# Altium project Walter_MotherBoard.PrjPcb
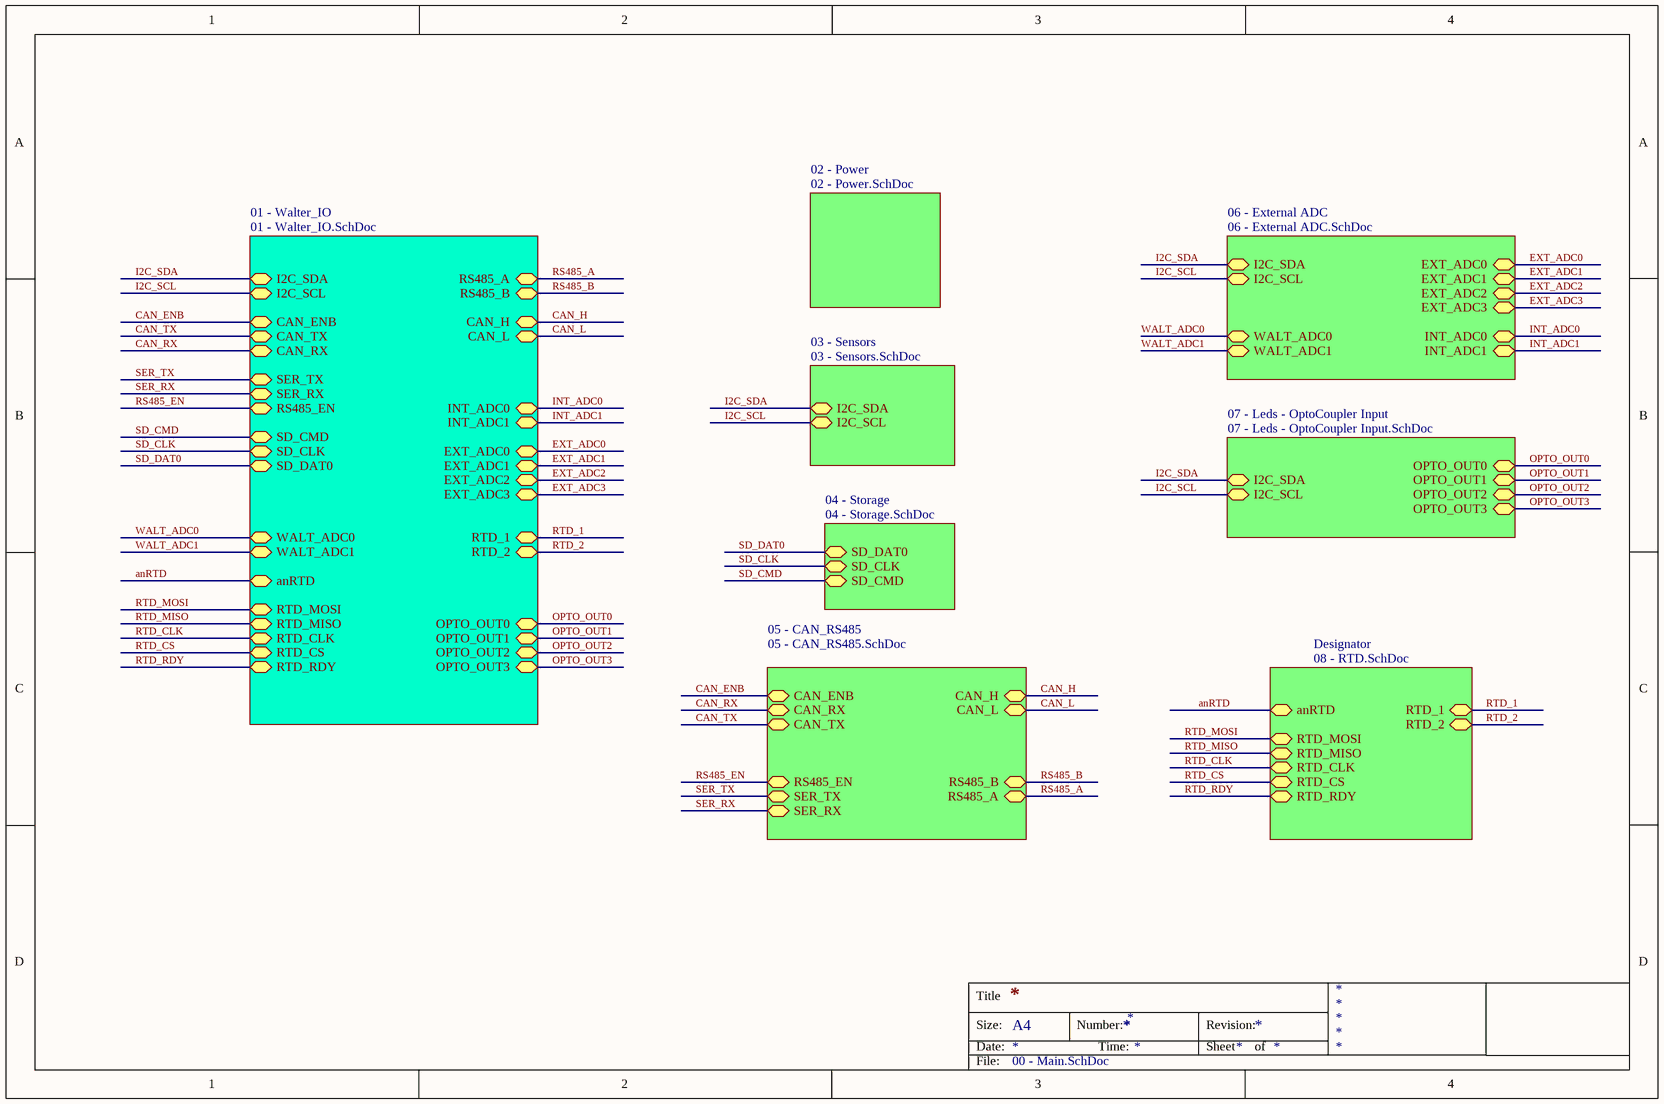
[diagram p0: 00 - Main.SchDoc]
9 sheets, 134 parts. Net scope: global (net labels, ports and power ports of the same name join across sheets).
Board file: SBTech_IcarusBoard_1V0.PcbDoc
Sheets:
  00 - Main.SchDoc
    02 - Power = 02 - Power.SchDoc
    03 - Sensors = 03 - Sensors.SchDoc
    04 - Storage = 04 - Storage.SchDoc
    05 - CAN_RS485 = 05 - CAN_RS485.SchDoc
    06 - External ADC = 06 - External ADC.SchDoc
    07 - Leds - OptoCoupler Input = 07 - Leds - OptoCoupler Input.SchDoc
    Designator = 08 - RTD.SchDoc
    01 - Walter_IO = 01 - Walter_IO.SchDoc

## Sheet 00 - Main.SchDoc
size A4

### Sub-sheets
01 - Walter_IO = 01 - Walter_IO.SchDoc: CAN_L (bidir), CAN_H (bidir), INT_ADC1 (bidir), WALT_ADC0 (bidir), EXT_ADC3 (bidir), INT_ADC0 (bidir), I2C_SDA (bidir), RS485_B (bidir), SD_DAT0 (bidir), RS485_A (bidir), I2C_SCL (bidir), SER_TX (bidir), SD_CMD (bidir), SD_CLK (bidir), SER_RX (bidir), EXT_ADC2 (bidir), EXT_ADC1 (bidir), CAN_RX (bidir), CAN_TX (bidir), RS485_EN (bidir), EXT_ADC0 (bidir), OPTO_OUT3 (bidir), RTD_MISO (bidir), RTD_2 (bidir), OPTO_OUT1 (bidir), RTD_RDY (bidir), OPTO_OUT0 (bidir), RTD_MOSI (bidir), RTD_CLK (bidir), WALT_ADC1 (bidir), OPTO_OUT2 (bidir), RTD_1 (bidir), RTD_CS (bidir), anRTD (bidir), CAN_ENB (bidir)
02 - Power = 02 - Power.SchDoc: no entries
03 - Sensors = 03 - Sensors.SchDoc: I2C_SCL (bidir), I2C_SDA (bidir)
04 - Storage = 04 - Storage.SchDoc: SD_DAT0 (bidir), SD_CLK (bidir), SD_CMD (bidir)
05 - CAN_RS485 = 05 - CAN_RS485.SchDoc: CAN_H (bidir), CAN_L (bidir), SER_TX (bidir), SER_RX (bidir), RS485_A (bidir), CAN_TX (bidir), CAN_RX (bidir), RS485_B (bidir), RS485_EN (bidir), CAN_ENB (bidir)
06 - External ADC = 06 - External ADC.SchDoc: I2C_SDA (bidir), I2C_SCL (bidir), WALT_ADC0 (bidir), EXT_ADC0 (bidir), EXT_ADC1 (bidir), INT_ADC0 (bidir), EXT_ADC2 (bidir), EXT_ADC3 (bidir), INT_ADC1 (bidir), WALT_ADC1 (bidir)
07 - Leds - OptoCoupler Input = 07 - Leds - OptoCoupler Input.SchDoc: OPTO_OUT1 (bidir), OPTO_OUT3 (bidir), OPTO_OUT2 (bidir), OPTO_OUT0 (bidir), I2C_SDA (bidir), I2C_SCL (bidir)
Designator = 08 - RTD.SchDoc: anRTD (bidir), RTD_1 (bidir), RTD_MISO (bidir), RTD_CLK (bidir), RTD_CS (bidir), RTD_RDY (bidir), RTD_2 (bidir), RTD_MOSI (bidir)

### Nets
anRTD: sheet Designator/anRTD, sheet 01 - Walter_IO/anRTD
CAN_ENB: sheet 05 - CAN_RS485/CAN_ENB, sheet 01 - Walter_IO/CAN_ENB
CAN_H: sheet 05 - CAN_RS485/CAN_H, sheet 01 - Walter_IO/CAN_H
CAN_L: sheet 05 - CAN_RS485/CAN_L, sheet 01 - Walter_IO/CAN_L
CAN_RX: sheet 05 - CAN_RS485/CAN_RX, sheet 01 - Walter_IO/CAN_RX
CAN_TX: sheet 05 - CAN_RS485/CAN_TX, sheet 01 - Walter_IO/CAN_TX
EXT_ADC0: sheet 06 - External ADC/EXT_ADC0, sheet 01 - Walter_IO/EXT_ADC0
EXT_ADC1: sheet 06 - External ADC/EXT_ADC1, sheet 01 - Walter_IO/EXT_ADC1
EXT_ADC2: sheet 06 - External ADC/EXT_ADC2, sheet 01 - Walter_IO/EXT_ADC2
EXT_ADC3: sheet 06 - External ADC/EXT_ADC3, sheet 01 - Walter_IO/EXT_ADC3
I2C_SCL: sheet 03 - Sensors/I2C_SCL, sheet 06 - External ADC/I2C_SCL, sheet 07 - Leds - OptoCoupler Input/I2C_SCL, sheet 01 - Walter_IO/I2C_SCL
I2C_SDA: sheet 03 - Sensors/I2C_SDA, sheet 06 - External ADC/I2C_SDA, sheet 07 - Leds - OptoCoupler Input/I2C_SDA, sheet 01 - Walter_IO/I2C_SDA
INT_ADC0: sheet 06 - External ADC/INT_ADC0, sheet 01 - Walter_IO/INT_ADC0
INT_ADC1: sheet 06 - External ADC/INT_ADC1, sheet 01 - Walter_IO/INT_ADC1
OPTO_OUT0: sheet 07 - Leds - OptoCoupler Input/OPTO_OUT0, sheet 01 - Walter_IO/OPTO_OUT0
OPTO_OUT1: sheet 07 - Leds - OptoCoupler Input/OPTO_OUT1, sheet 01 - Walter_IO/OPTO_OUT1
OPTO_OUT2: sheet 07 - Leds - OptoCoupler Input/OPTO_OUT2, sheet 01 - Walter_IO/OPTO_OUT2
OPTO_OUT3: sheet 07 - Leds - OptoCoupler Input/OPTO_OUT3, sheet 01 - Walter_IO/OPTO_OUT3
RS485_A: sheet 05 - CAN_RS485/RS485_A, sheet 01 - Walter_IO/RS485_A
RS485_B: sheet 05 - CAN_RS485/RS485_B, sheet 01 - Walter_IO/RS485_B
RS485_EN: sheet 05 - CAN_RS485/RS485_EN, sheet 01 - Walter_IO/RS485_EN
RTD_1: sheet Designator/RTD_1, sheet 01 - Walter_IO/RTD_1
RTD_2: sheet Designator/RTD_2, sheet 01 - Walter_IO/RTD_2
RTD_CLK: sheet Designator/RTD_CLK, sheet 01 - Walter_IO/RTD_CLK
RTD_CS: sheet Designator/RTD_CS, sheet 01 - Walter_IO/RTD_CS
RTD_MISO: sheet Designator/RTD_MISO, sheet 01 - Walter_IO/RTD_MISO
RTD_MOSI: sheet Designator/RTD_MOSI, sheet 01 - Walter_IO/RTD_MOSI
RTD_RDY: sheet Designator/RTD_RDY, sheet 01 - Walter_IO/RTD_RDY
SD_CLK: sheet 04 - Storage/SD_CLK, sheet 01 - Walter_IO/SD_CLK
SD_CMD: sheet 04 - Storage/SD_CMD, sheet 01 - Walter_IO/SD_CMD
SD_DAT0: sheet 04 - Storage/SD_DAT0, sheet 01 - Walter_IO/SD_DAT0
SER_RX: sheet 05 - CAN_RS485/SER_RX, sheet 01 - Walter_IO/SER_RX
SER_TX: sheet 05 - CAN_RS485/SER_TX, sheet 01 - Walter_IO/SER_TX
WALT_ADC0: sheet 06 - External ADC/WALT_ADC0, sheet 01 - Walter_IO/WALT_ADC0
WALT_ADC1: sheet 06 - External ADC/WALT_ADC1, sheet 01 - Walter_IO/WALT_ADC1

### Notes on the sheet
- Title
- Size:
- Date:
- A4
- Number:
- Time:
- Revision:
- Sheet
- of
- File:

## Sheet 02 - Power.SchDoc
size A4
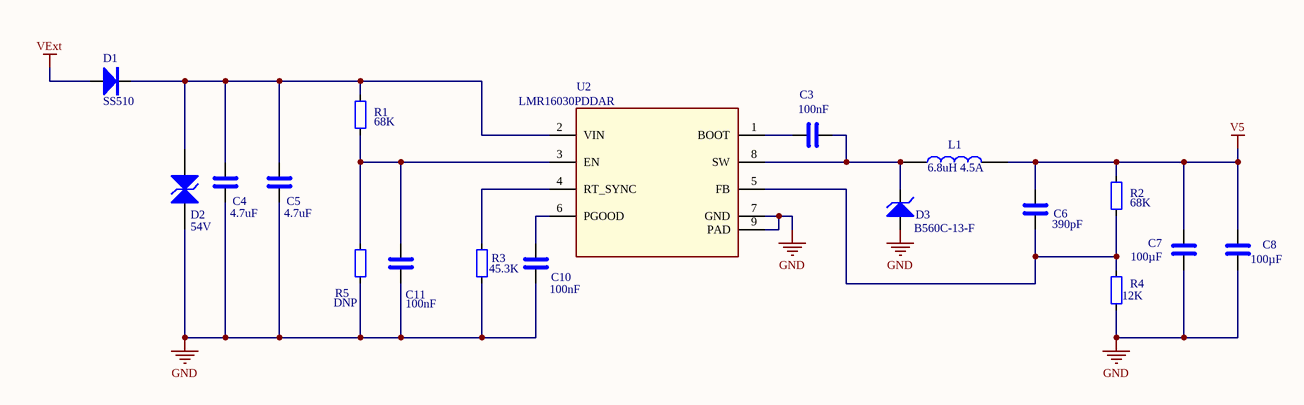
[diagram p1: 02 - Power.SchDoc]

### Parts
C3  100nF  [CAP_0603]
C4  4.7uF  [C_1210_3225Metric]
C5  4.7uF  [C_1210_3225Metric]
C6  390pF  [CAP_0603]
C7  100µF  [C_1210_3225Metric]
C8  100µF  [C_1210_3225Metric]
C10  100nF  [CAP_0603]
C11  100nF  [CAP_0603]
D1  value SS510  [S1M-13-F]  (hidden comment: DIODE SCHOTTKY 100V 5A DO214AC)
D2  value 54V  [SMBJ54CA-HT]  (hidden comment: SMBJ54CA-HT)
D3  B560C-13-F  [SMC_DIO]
L1  6.8uH 4.5A  [IHLP2525CZER6R8M01]
R1  68K  [RES_0603]
R2  68K  [RES_0603]
R3  45.3K  [RES_0603]
R4  12K  [RES_0603]
R5  DNP  [RES_0603]
U2  LMR16030PDDAR  [LMR16030PDDAR]

### Nets
GND: C4.2 C5.2 C7.2 C8.2 C10.2 C11.2 D2.1(A) D3.2(A) R3.1 R4.1 R5.1 U2.7(GND) U2.9(PAD)
V5: C6.1 C7.1 C8.1 L1.2 R2.2
VExt: D1.2(A)
NetC3_1: C3.1 U2.1(BOOT)
NetC3_2: C3.2 D3.1(K) L1.1 U2.8(SW)
NetC4_1: C4.1 C5.1 D1.1(K) D2.2(K) R1.2 U2.2(VIN)
NetC6_2: C6.2 R2.1 R4.2 U2.5(FB)
NetC10_1: C10.1 U2.6(PGOOD)
NetC11_1: C11.1 R1.1 R5.2 U2.3(EN)
NetR3_2: R3.2 U2.4(RT_SYNC)

### Notes on the sheet
- Title
- Size:
- Date:
- A4
- Number:
- Time:
- Revision:
- Sheet
- of
- File:

### Library data of the parts
C3 C10 C11 = C: pdf: https://www.lcsc.com/datasheet/lcsc_datasheet_2501031500_HRE-CGA0603X7R104K500JT_C6119867.pdf; LCSC PART: C6119867; lcsc link: https://www.lcsc.com/product-detail/Multilayer-Ceramic-Capacitors-MLCC-SMD-SMT_HRE-CGA0603X7R104K500JT_C6119867.html?s_z=n_100nF; JLCPCB: C6119867; Value: 100nF
C4 C5 = C: Value: 4.7uF 100V; JLCPCB: C381466; LCSC PART: C381466; lcsc link: https://www.lcsc.com/product-detail/Multilayer-Ceramic-Capacitors-MLCC-SMD-SMT_PSA-Prosperity-Dielectrics-FS32X475K101EGG_C381466.html
C6 = C: 50V 390pF X7R ±10% 0603 Multilayer Ceramic Capacitors MLCC - SMD/SMT ROHS; JLCPCB: C1617; Value: 390pF; LCSC PART: C1617; lcsc link: https://www.lcsc.com/product-detail/Multilayer-Ceramic-Capacitors-MLCC-SMD-SMT_FH-Guangdong-Fenghua-Advanced-Tech-0603B391K500NT_C1617.html?s_z=n_390pF
C7 C8 = C: 6.3V 100uF X5R ±20% 1210 Multilayer Ceramic Capacitors MLCC - SMD/SMT ROHS; JLCPCB: C49066; Value: 100µF; LCSC PART: C49066; lcsc link: https://www.lcsc.com/product-detail/Multilayer-Ceramic-Capacitors-MLCC-SMD-SMT_Samsung-Electro-Mechanics-CL32A107MQVNNNE_C49066.html?s_z=n_C49066
D1 = DIODE SCHOTTKY 100V 5A DO214AC: MFN: SS510-HT; STOK KOD: HM0953; TYPE: SMD; NAME: DIODE SCHOTTKY 100V 5A DO214AC; Datasheet: https://www.smc-diodes.com/propdf/SK510%20N1113%20REV.A.pdf; lcsc link: https://www.lcsc.com/product-detail/Schottky-Diodes_MDD-Microdiode-Semiconductor-SS510_C65010.html; JLCPCB: C65010; LCSC PART: C65010; pdf: https://www.lcsc.com/datasheet/lcsc_datasheet_2411211954_MDD-Microdiode-Semiconductor-SS510_C65010.pdf
D2 = DIODE TVS 600W 54V DO214AA SMB: 600W Bidirectional 54V SMB ESD and Surge Protection (TVS/ESD) ROHS; STOK KOD: HM0531; TYPE: SMD; MFN: SMBJ54CA-HT; NAME: DIODE TVS 600W 54V DO214AA SMB; Datasheet: https://www.littelfuse.com/~/media/electronics/datasheets/tvs_diodes/littelfuse_tvs_diode_smbj_datasheet.pdf.pdf; lcsc link: https://www.lcsc.com/product-detail/ESD-and-Surge-Protection-TVS-ESD_FOSAN-SMBJ54CA_C5353227.html?s_z=n_SMBJ54CA; LCSC PART: C5353227; pdf: https://www.lcsc.com/datasheet/lcsc_datasheet_2301131609_FOSAN-SMBJ54CA_C5353227.pdf; JLCPCB: C5353227
D3 = B560C: 60V 700mV@5A 5A SMC(DO-214AB) Schottky Diodes ROHS; Value: B560C-13-F; LCSC PART: C85100; JLCPCB: C85100; lcsc link: https://www.lcsc.com/product-detail/Schottky-Diodes_Diodes-Incorporated-B560C-13-F_C85100.html?s_z=n_b560c; pdf: https://www.lcsc.com/datasheet/lcsc_datasheet_2412251154_Diodes-Incorporated-B560C-13-F_C85100.pdf
L1 = FIXED IND 6.8UH 4.5A 60 MOHM SMD: 4.5A 6.8uH ±20% 8A SMD,6.5x6.9mm Power Inductors ROHS; MFN: IHLP2525CZER6R8M01; TYPE: SMD; JLCPCB: C506575; LCSC PART: C506575; lcsc link: https://www.lcsc.com/product-detail/Power-Inductors_Vishay-Intertech-IHLP2525CZER6R8M01_C506575.html?s_z=n_IHLP2525CZER6R8M01; pdf: https://www.lcsc.com/datasheet/lcsc_datasheet_2409300703_Vishay-Intertech-IHLP2525CZER6R8M01_C506575.pdf; Value: 6.8uH 4.5A
R1-R5 = R
  R1 R2: Value: 68K; JLCPCB: C114633; LCSC PART: C114633; lcsc link: https://www.lcsc.com/product-detail/Chip-Resistor-Surface-Mount_YAGEO-RC0603FR-0768KL_C114633.html?s_z=n_68K
  R3: Value: 45.3K; LCSC PART: C23058; JLCPCB: C23058; lcsc link: https://www.lcsc.com/product-detail/Chip-Resistor-Surface-Mount_UNI-ROYAL-Uniroyal-Elec-0603WAF4532T5E_C23058.html
  R4: Value: 12K; JLCPCB: C114659; LCSC PART: C114659; lcsc link: https://www.lcsc.com/product-detail/Chip-Resistor-Surface-Mount_YAGEO-RC0603FR-0712KL_C114659.html?s_z=n_12k
  R5: Value: DNP
U2 = IC REG BUCK ADJUSTABLE 3A 8SOPWR: Step-down type Adjustable 800mV~50V 3A 4.3V~60V SOIC-8-EP DC-DC Converters ROHS; STOK KOD: HM0056; MFN: LMR16030PDDAR; TYPE: SMD; NAME: IC REG BUCK ADJUSTABLE 3A 8SOPWR; Datasheet: https://www.ti.com/general/docs/suppproductinfo.tsp?distId=10&gotoUrl=https%3A%2F%2Fwww.ti.com%2Flit%2Fgpn%2Flmr16030; LCSC PART: C90665; JLCPCB: C90665; lcsc link: https://www.lcsc.com/product-detail/DC-DC-Converters_Texas-Instruments-LMR16030PDDAR_C90665.html?s_z=n_LMR16030PDDAR; pdf: https://www.lcsc.com/datasheet/lcsc_datasheet_2410121701_Texas-Instruments-LMR16030PDDAR_C90665.pdf; Value: LMR16030PDDAR

## Sheet 03 - Sensors.SchDoc
size A4
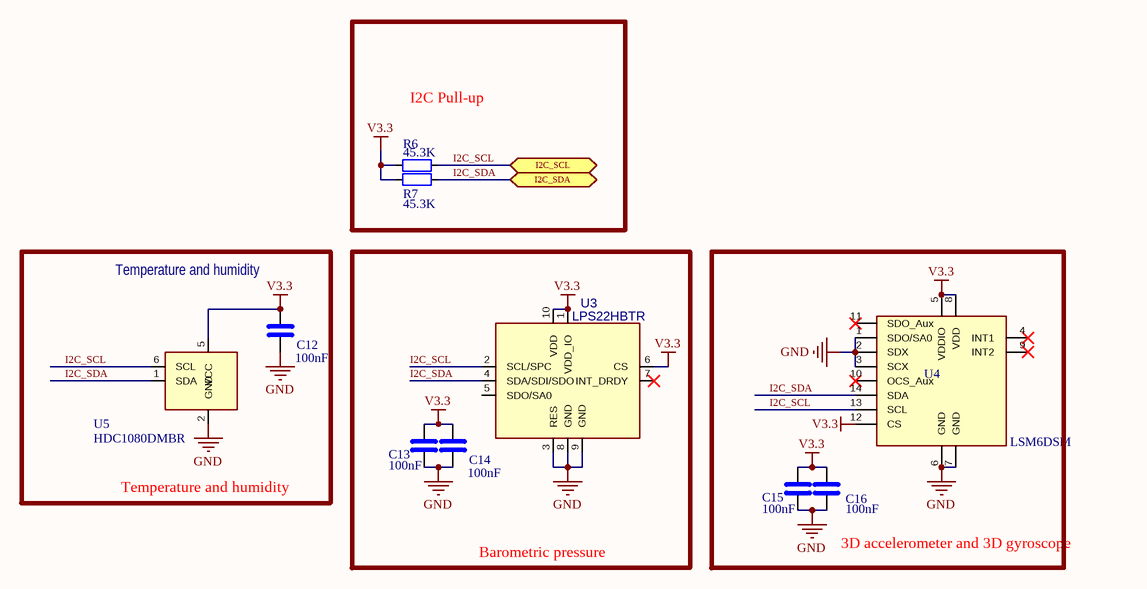
[diagram p2: 03 - Sensors.SchDoc]

### Parts
C12  100nF  [CAP_0603]
C13  100nF  [CAP_0603]
C14  100nF  [CAP_0603]
C15  100nF  [CAP_0603]
C16  100nF  [CAP_0603]
R6  45.3K  [RES_0603]
R7  45.3K  [RES_0603]
U3  value LPS22HBTR  [HLGA10_2X2_STM-L]  (hidden comment: LPS22HH)
U4  LSM6DSM  [LGA-14_3x2.5mm_P0.5mm_LayoutBorder3x4y]
U5  HDC1080DMBR  [Texas_PWSON-N6]

### Blocks framed on the sheet
I2C Pull-up: R6 R7
Barometric pressure: C13 C14 U3
3D accelerometer and 3D gyroscope: C15 C16 U4

### Ports
I2C_SCL (bidir), I2C_SDA (bidir)

### Nets
GND: C12.2 C13.2 C14.2 C15.2 C16.2 U3.3(RES) U3.8(GND) U3.9(GND) U4.1(SDO/SA0) U4.2(SDX) U4.3(SCX) U4.6(GND) U4.7(GND) U5.2(GND)
V3.3: C12.1 C13.1 C14.1 C15.1 C16.1 R6.2 R7.2 U3.1(VDD_IO) U3.6(CS) U3.10(VDD) U4.5(VDDIO) U4.8(VDD) U4.12(CS) U5.5(VCC)
I2C_SCL: R6.1 U3.2(SCL/SPC) U4.13(SCL) U5.6(SCL) ; port I2C_SCL
I2C_SDA: R7.1 U3.4(SDA/SDI/SDO) U4.14(SDA) U5.1(SDA) ; port I2C_SDA

Not connected (* = marked no-connect by the designer): U3 5(SDO/SA0) 7(INT_DRDY)*; U4 4(INT1)* 9(INT2)* 10(OCS_Aux)* 11(SDO_Aux)*; U5 3(NC) 4(NC) 7(DAP)

### Notes on the sheet
- (near C12) Temperature and humidity
- Temperature and humidity
- Title
- Size:
- Date:
- A4
- Number:
- Time:
- Revision:
- Sheet
- of
- File:

### Library data of the parts
C12-C16 = C: pdf: https://www.lcsc.com/datasheet/lcsc_datasheet_2501031500_HRE-CGA0603X7R104K500JT_C6119867.pdf; LCSC PART: C6119867; lcsc link: https://www.lcsc.com/product-detail/Multilayer-Ceramic-Capacitors-MLCC-SMD-SMT_HRE-CGA0603X7R104K500JT_C6119867.html?s_z=n_100nF; JLCPCB: C6119867; Value: 100nF
R6 R7 = R: Value: 45.3K; LCSC PART: C23058; JLCPCB: C23058; lcsc link: https://www.lcsc.com/product-detail/Chip-Resistor-Surface-Mount_UNI-ROYAL-Uniroyal-Elec-0603WAF4532T5E_C23058.html
U3 = LPS22HBTR: 26Kpa~126Kpa HLGA-10(2x2) Pressure Sensors ROHS; LCSC PART: C2827824; Footprint: LPS22HBTR:HLGA10_2X2_STM-L; lcsc link: https://www.lcsc.com/product-detail/Pressure-Sensors_STMicroelectronics-LPS22HHTR_C2827824.html; pdf: https://www.lcsc.com/datasheet/lcsc_datasheet_2209222100_STMicroelectronics-LPS22HHTR_C2827824.pdf; JLCPCB: C2827824
U5 = HDC1080: JLCPCB: C82227; Value: HDC1080DMBR; Footprint: Package_SON:Texas_PWSON-N6; LCSC PART: C82227; lcsc link: https://www.lcsc.com/product-detail/Temperature-and-Humidity-Sensor_Texas-Instruments-HDC1080DMBR_C82227.html?s_z=n_C82227; pdf: https://www.ti.com/lit/ds/symlink/hdc1080.pdf?ts=1737300187160&ref_url=https%253A%252F%252Fwww.google.com%252F
U4 = LSM6DSM: JLCPCB: C94048; Value: LSM6DSM; Footprint: Package_LGA:LGA-14_3x2.5mm_P0.5mm_LayoutBorder3x4y; LCSC PART: C94048; lcsc link: https://www.lcsc.com/product-detail/Accelerometers_STMicroelectronics-LSM6DSMTR_C94048.html?s_z=n_C94048; pdf: https://www.lcsc.com/datasheet/lcsc_datasheet_1811101102_STMicroelectronics-LSM6DSMTR_C94048.pdf

## Sheet 04 - Storage.SchDoc
size A4
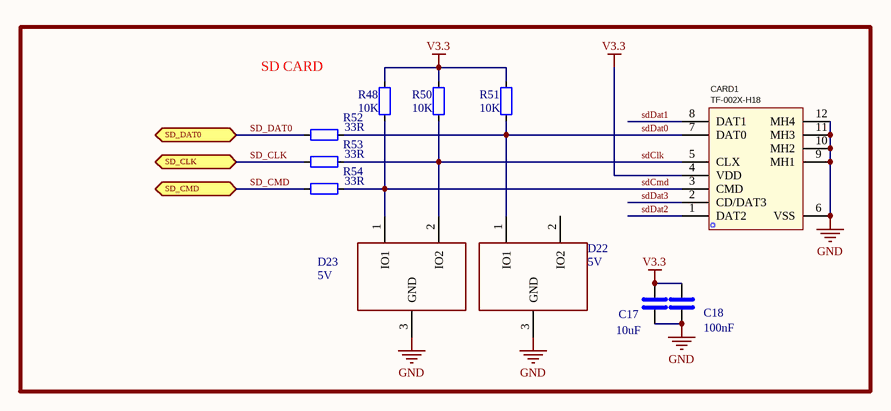
[diagram p3: 04 - Storage.SchDoc]

### Parts
C17  10uF  [CAP_0805]
C18  100nF  [CAP_0603]
CARD1  TF-002X-H18  [SIM-SMD_TF-002-H18]
D22  value 5V  [TPD2E2U06DCKR]  (hidden comment: Q100 TO CATALOG SPIN OF TPD2E2U0)
D23  value 5V  [TPD2E2U06DCKR]  (hidden comment: Q100 TO CATALOG SPIN OF TPD2E2U0)
R48  value 10K  [RES_0603]  (hidden comment: 10K 1%)
R50  value 10K  [RES_0603]  (hidden comment: 10K 1%)
R51  value 10K  [RES_0603]  (hidden comment: 10K 1%)
R52  33R  [RES_0603]
R53  33R  [RES_0603]
R54  33R  [RES_0603]

### Blocks framed on the sheet
SD CARD: C17 C18 CARD1 D22 D23 R48 R50-R54

### Ports
SD_CLK (bidir), SD_CMD (bidir), SD_DAT0 (bidir)

### Nets
GND: C17.2 C18.2 CARD1.6(VSS) CARD1.9(MH1) CARD1.10(MH2) CARD1.11(MH3) CARD1.12(MH4) D22.3(GND) D23.3(GND)
V3.3: C17.1 C18.1 CARD1.4(VDD) R48.1 R50.1 R51.1
SD_CLK: R53.1 ; port SD_CLK
SD_CMD: R54.1 ; port SD_CMD
SD_DAT0: R52.1 ; port SD_DAT0
sdClk: CARD1.5(CLX) D23.2(IO2) R50.2 R53.2
sdCmd: CARD1.3(CMD) D23.1(IO1) R48.2 R54.2
sdDat0: CARD1.7(DAT0) D22.1(IO1) R51.2 R52.2
sdDat1: CARD1.8(DAT1)
sdDat2: CARD1.1(DAT2)
sdDat3: CARD1.2(CD/DAT3)

Not connected (* = marked no-connect by the designer): D22 2(IO2)

### Notes on the sheet
- Title
- Size:
- Date:
- A4
- Number:
- Time:
- Revision:
- Sheet
- of
- File:

### Library data of the parts
C17 C18 = C
  C17: Value: 10uF; lcsc link: https://www.lcsc.com/product-detail/Multilayer-Ceramic-Capacitors-MLCC-SMD-SMT_Samsung-Electro-Mechanics-CL21A106KOQNNNE_C1713.html?s_z=n_C1713; LCSC PART: C1713; JLCPCB: C1713
  C18: pdf: https://www.lcsc.com/datasheet/lcsc_datasheet_2501031500_HRE-CGA0603X7R104K500JT_C6119867.pdf; LCSC PART: C6119867; lcsc link: https://www.lcsc.com/product-detail/Multilayer-Ceramic-Capacitors-MLCC-SMD-SMT_HRE-CGA0603X7R104K500JT_C6119867.html?s_z=n_100nF; JLCPCB: C6119867; Value: 100nF
CARD1 = TF-002X-H18: Card Slot MicroSD card (TF card) Flip type SMD SD Card / Memory Card Connector ROHS; Manufacturer: SOFNG(硕方); Symbol: TF-002-H18; Add into BOM: yes; Device: TF-002X-H18; LCSC Part Name: 翻盖式 MicroSD卡(TF卡) 卡座; Supplier Part: C125814; Manufacturer Part: TF-002X-H18; Supplier Footprint: SMD; JLCPCB Part Class: Extended Part; Datasheet: https://atta.szlcsc.com/upload/public/pdf/source/20200313/C125814_E45762AFA89F96AEF2D8FC2220BDEE92.pdf; Supplier: LCSC; Convert to PCB: yes; Card Connection Mode: Flip type; Card Type: MicroSD card (TF card); Connector Type: Card Slot; Maximum Body Height: -; Operating Temperature Range: -; pdf: https://www.lcsc.com/datasheet/lcsc_datasheet_2410121543_SOFNG-TF-002X-H18_C125814.pdf; lcsc link: https://www.lcsc.com/product-detail/SD-Card-Memory-Card-Connector_SOFNG-TF-002X-H18_C125814.html?s_z=n_microsd; LCSC PART: C125814; Value: TF-002X-H18; JLCPCB: C125814; JLCPCB: C458218
D22 D23 = Q100 TO CATALOG SPIN OF TPD2E2U0: TYPE: SMD; STOK KOD: HM0072; MFN: TPD2E2U06DCKR; NAME: Q100 TO CATALOG SPIN OF TPD2E2U0; JLCPCB: C5310938; LCSC PART: C5310938; lcsc link: https://www.lcsc.com/product-detail/ESD-and-Surge-Protection-TVS-ESD_TECH-PUBLIC-TPD2E2U06QDCKR-TP_C5310938.html?s_z=n_TPD2E2U0; pdf: https://www.lcsc.com/datasheet/lcsc_datasheet_2411121117_TECH-PUBLIC-TPD2E2U06QDCKR-TP_C5310938.pdf
R48 R50 R51 = R: JLCPCB: C25804; LCSC PART: C25804; lcsc link: https://www.lcsc.com/product-detail/Chip-Resistor-Surface-Mount_UNI-ROYAL-Uniroyal-Elec-0603WAF1002T5E_C25804.html
R52-R54 = R: 100mW Thick Film Resistors 75V ±100ppm/℃ ±1% 33Ω 0603 Chip Resistor - Surface Mount ROHS; Value: 33R; LCSC PART: C23140; JLCPCB: C23140; lcsc link: https://www.lcsc.com/product-detail/Chip-Resistor-Surface-Mount_UNI-ROYAL-Uniroyal-Elec-0603WAF330JT5E_C23140.html

## Sheet 05 - CAN_RS485.SchDoc
size A4
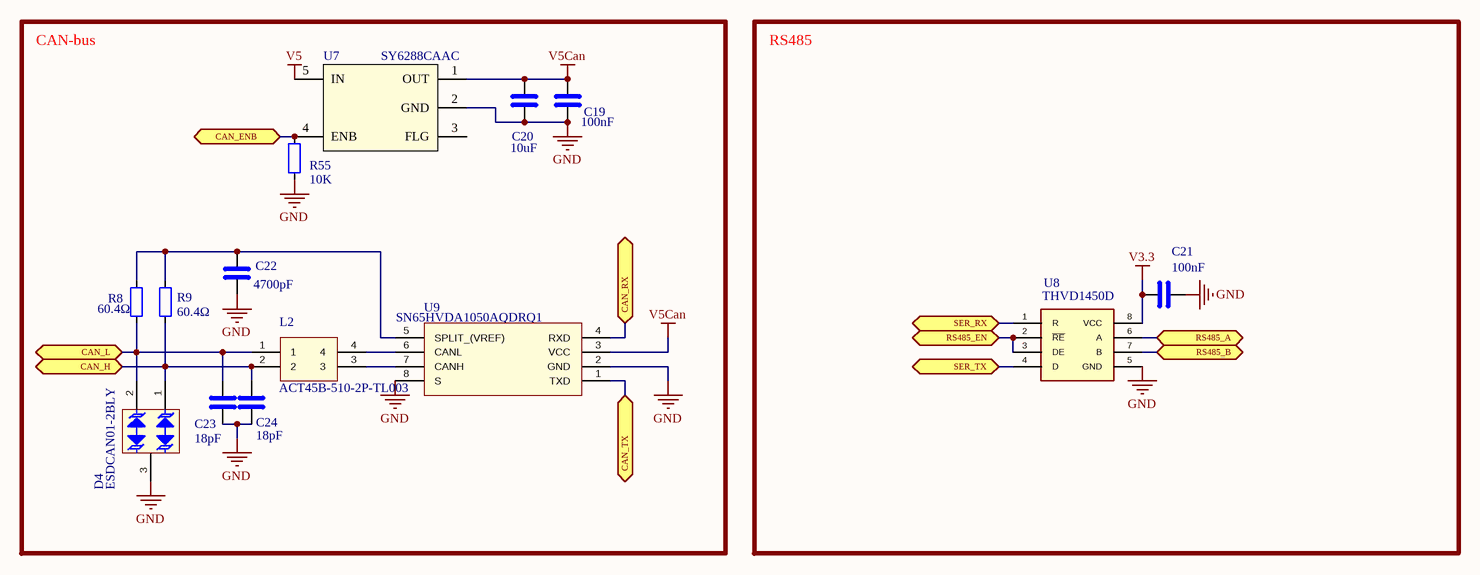
[diagram p4: 05 - CAN_RS485.SchDoc]

### Parts
C19  100nF  [CAP_0603]
C20  10uF  [CAP_0805]
C21  100nF  [CAP_0603]
C22  4700pF  [CAP_0603]
C23  18pF  [CAP_0603]
C24  18pF  [CAP_0603]
D4  ESDCAN01-2BLY  [SOT95P255X150-3N]
L2  ACT45B-510-2P-TL003  [ACT45B1012PTL003]
R8  60.4Ω  [RES_0603]
R9  60.4Ω  [RES_0603]
R55  value 10K  [RES_0603]  (hidden comment: 10K 1%)
U7  SY6288CAAC  [SOT95P285X145-5N]
U8  THVD1450D  [SOIC127P600]
U9  SN65HVDA1050AQDRQ1  [SOIC127P600]

### Blocks framed on the sheet
CAN-bus: C19 C20 C22-C24 D4 L2 R8 R9 R55 U7 U9
RS485: C21 U8

### Ports
CAN_ENB (bidir), CAN_H (bidir), CAN_L (bidir), CAN_RX (bidir), CAN_TX (bidir), RS485_A (bidir), RS485_B (bidir), RS485_EN (bidir), SER_RX (bidir), SER_TX (bidir)

### Nets
GND: C19.2 C20.2 C21.2 C22.2 C23.2 C24.2 D4.3 R55.2 U7.2(GND) U8.5(GND) U9.2(GND) U9.8(S)
V3.3: C21.1 U8.8(VCC)
V5: U7.5(IN)
V5Can: C19.1 C20.1 U7.1(OUT) U9.3(VCC)
CAN_ENB: R55.1 U7.4(ENB) ; port CAN_ENB
CAN_H: C23.1 D4.2 L2.1 R8.1 ; port CAN_L
CAN_L: C24.1 D4.1 L2.2 R9.1 ; port CAN_H
CAN_RX: U9.4(RXD) ; port CAN_RX
CAN_TX: U9.1(TXD) ; port CAN_TX
RS485_A: U8.6(A) ; port RS485_A
RS485_B: U8.7(B) ; port RS485_B
RS485_EN: U8.2(~{RE}) U8.3(DE) ; port RS485_EN
SER_RX: U8.1(R) ; port SER_RX
SER_TX: U8.4(D) ; port SER_TX
NetC22_1: C22.1 R8.2 R9.2 U9.5(SPLIT_(VREF))
NetL2_3: L2.3 U9.7(CANH)
NetL2_4: L2.4 U9.6(CANL)

Not connected (* = marked no-connect by the designer): U7 3(FLG)

### Notes on the sheet
- Title
- Size:
- Date:
- A4
- Number:
- Time:
- Revision:
- Sheet
- of
- File:

### Library data of the parts
C19-C22 = C
  C19 C21: pdf: https://www.lcsc.com/datasheet/lcsc_datasheet_2501031500_HRE-CGA0603X7R104K500JT_C6119867.pdf; LCSC PART: C6119867; lcsc link: https://www.lcsc.com/product-detail/Multilayer-Ceramic-Capacitors-MLCC-SMD-SMT_HRE-CGA0603X7R104K500JT_C6119867.html?s_z=n_100nF; JLCPCB: C6119867; Value: 100nF
  C20: Value: 10uF; lcsc link: https://www.lcsc.com/product-detail/Multilayer-Ceramic-Capacitors-MLCC-SMD-SMT_Samsung-Electro-Mechanics-CL21A106KOQNNNE_C1713.html?s_z=n_C1713; LCSC PART: C1713; JLCPCB: C1713
  C22: JLCPCB: C7503499; Value: 4700pF; lcsc link: https://www.lcsc.com/product-detail/Multilayer-Ceramic-Capacitors-MLCC-SMD-SMT_HRE-CGA0603X7R472K500JT_C7503499.html; LCSC PART: C7503499
C23 C24 = C: 50V 18pF X7R ±10% 0603 Multilayer Ceramic Capacitors MLCC - SMD/SMT ROHS; Value: 18pF; Footprint: Capacitor_SMD:C_0603_1608Metric; LCSC PART: C6119867; lcsc link: https://www.lcsc.com/product-detail/Multilayer-Ceramic-Capacitors-MLCC-SMD-SMT_HRE-CGA0603X7R104K500JT_C6119867.html; JLCPCB: C6119867
D4 = ESDCAN01-2BLY: 5.5A@8/20us 230W 40V 25V 24V SOT-23 ESD and Surge Protection (TVS/ESD) ROHS; PAGE: DPESDCAN01; JLCPCB: C1976606; Value: ESDCAN01-2BLY; LCSC PART: C1976606; lcsc link: https://www.lcsc.com/product-detail/ESD-and-Surge-Protection-TVS-ESD_STMicroelectronics-ESDCAN01-2BLY_C1976606.html?s_z=n_C1976606; pdf: https://www.lcsc.com/datasheet/lcsc_datasheet_2410010332_STMicroelectronics-ESDCAN01-2BLY_C1976606.pdf
L2 = ACT45B-510-2P-TL003: 51uH@100kHz 2.8kΩ@10MHz 1Ω 2 SMD,4.5x3.2mm Common Mode Filters ROHS; PAGE: L51UHACT45B; JLCPCB: C76584; Value: ACT45B-510-2P-TL003; LCSC PART: C76584; lcsc link: https://www.lcsc.com/product-detail/Common-Mode-Filters_TDK-ACT45B-510-2P-TL003_C76584.html?s_z=n_C76584; pdf: https://www.lcsc.com/datasheet/lcsc_datasheet_2412231058_TDK-ACT45B-510-2P-TL003_C76584.pdf
R8 R9 = R: 100mW Thick Film Resistors 75V ±100ppm/℃ ±1% 60.4Ω 0603 Chip Resistor - Surface Mount ROHS; Value: 60.4Ω; JLCPCB: C23090; LCSC PART: C23090; lcsc link: https://www.lcsc.com/product-detail/Chip-Resistor-Surface-Mount_UNI-ROYAL-Uniroyal-Elec-0603WAF604JT5E_C23090.html?s_z=n_60.4R
R55 = R: JLCPCB: C25804; LCSC PART: C25804; lcsc link: https://www.lcsc.com/product-detail/Chip-Resistor-Surface-Mount_UNI-ROYAL-Uniroyal-Elec-0603WAF1002T5E_C25804.html
U7 = AP22802A: 2.5V~5.5V 60mΩ Active High 2A 1 Load Switch SOT-23-5 Power Distribution Switches ROHS; Value: SY6288CAAC; JLCPCB: C111830; LCSC PART: C111830; lcsc link: https://www.lcsc.com/product-detail/Power-Distribution-Switches_Silergy-Corp-SY6288CAAC_C111830.html; pdf: https://www.lcsc.com/datasheet/lcsc_datasheet_1810010210_Silergy-Corp-SY6288CAAC_C111830.pdf
U9 = SN65HVDA1050AQDRQ1: PAGE: ICSN65HVDA1050A; JLCPCB: C115764; Value: SN65HVDA1050AQDRQ1; Footprint: SN65HVDA1050AQDRQ1:SOIC127P600X175-8N; pdf: https://www.lcsc.com/datasheet/lcsc_datasheet_2410010301_Texas-Instruments-SN65HVDA1050AQDRQ1_C115764.pdf; LCSC PART: C115764; lcsc link: https://www.lcsc.com/product-detail/CAN-Transceivers_Texas-Instruments-SN65HVDA1050AQDRQ1_C115764.html?s_z=n_C115764
U8 = THVD1450D: JLCPCB: C2671361; Value: THVD1450D; Footprint: THVD1450D:SOIC127P599X175-8N; LCSC PART: C2671361; lcsc link: https://www.lcsc.com/product-detail/RS-485-RS-422-ICs_Texas-Instruments-THVD1450DR_C2671361.html?s_z=n_C2671361; pdf: https://www.ti.com/lit/ds/symlink/thvd1450.pdf?HQS=dis-dk-null-digikeymode-dsf-pf-null-wwe&ts=1737388582157&ref_url=https%253A%252F%252Fwww.ti.com%252Fgeneral%252Fdocs%252Fsuppproductinfo.tsp%253FdistId%253D10%2526gotoUrl%253Dhttps%253A%252F%252Fwww.ti.com%252Flit%252Fgpn%252Fthvd1450

## Sheet 06 - External ADC.SchDoc
size A4
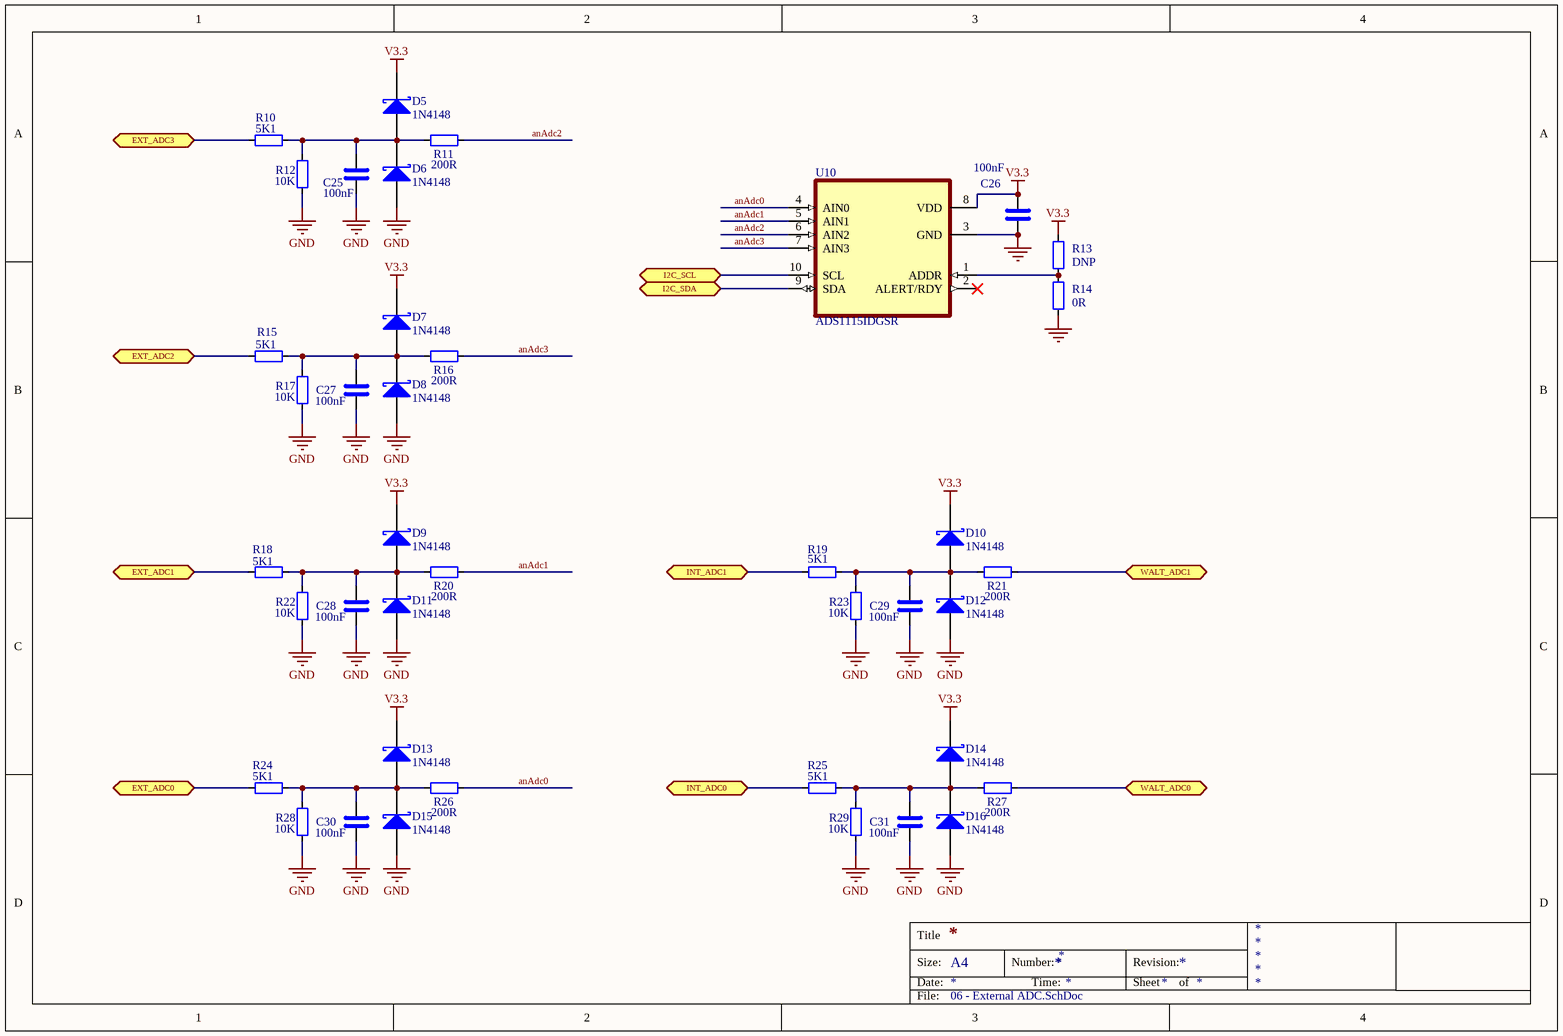
[diagram p5: 06 - External ADC.SchDoc]

### Parts
C25  100nF  [CAP_0603]
C26  100nF  [CAP_0603]
C27  100nF  [CAP_0603]
C28  100nF  [CAP_0603]
C29  100nF  [CAP_0603]
C30  100nF  [CAP_0603]
C31  100nF  [CAP_0603]
D5  1N4148  [SOD323_STM_NW]
D6  1N4148  [SOD323_STM_NW]
D7  1N4148  [SOD323_STM_NW]
D8  1N4148  [SOD323_STM_NW]
D9  1N4148  [SOD323_STM_NW]
D10  1N4148  [SOD323_STM_NW]
D11  1N4148  [SOD323_STM_NW]
D12  1N4148  [SOD323_STM_NW]
D13  1N4148  [SOD323_STM_NW]
D14  1N4148  [SOD323_STM_NW]
D15  1N4148  [SOD323_STM_NW]
D16  1N4148  [SOD323_STM_NW]
R10  value 5K1  [RES_0603]  (hidden comment: 5K1 1%)
R11  value 200R  [RES_0603]  (hidden comment: 200R %5)
R12  value 10K  [RES_0603]  (hidden comment: 10K 1%)
R13  DNP  [RES_0603]
R14  0R  [RES_0603]
R15  value 5K1  [RES_0603]  (hidden comment: 5K1 1%)
R16  value 200R  [RES_0603]  (hidden comment: 200R %5)
R17  value 10K  [RES_0603]  (hidden comment: 10K 1%)
R18  value 5K1  [RES_0603]  (hidden comment: 5K1 1%)
R19  value 5K1  [RES_0603]  (hidden comment: 5K1 1%)
R20  value 200R  [RES_0603]  (hidden comment: 200R %5)
R21  value 200R  [RES_0603]  (hidden comment: 200R %5)
R22  value 10K  [RES_0603]  (hidden comment: 10K 1%)
R23  value 10K  [RES_0603]  (hidden comment: 10K 1%)
R24  value 5K1  [RES_0603]  (hidden comment: 5K1 1%)
R25  value 5K1  [RES_0603]  (hidden comment: 5K1 1%)
R26  value 200R  [RES_0603]  (hidden comment: 200R %5)
R27  value 200R  [RES_0603]  (hidden comment: 200R %5)
R28  value 10K  [RES_0603]  (hidden comment: 10K 1%)
R29  value 10K  [RES_0603]  (hidden comment: 10K 1%)
U10  ADS1115IDGSR  [SOP50P490X110-10N]

### Ports
EXT_ADC0 (bidir), EXT_ADC1 (bidir), EXT_ADC2 (bidir), EXT_ADC3 (bidir), I2C_SCL (bidir), I2C_SDA (bidir), INT_ADC0 (bidir), INT_ADC1 (bidir), WALT_ADC0 (bidir), WALT_ADC1 (bidir)

### Nets
GND: C25.2 C26.2 C27.2 C28.2 C29.2 C30.2 C31.2 D6.2(A) D8.2(A) D11.2(A) D12.2(A) D15.2(A) D16.2(A) R12.1 R14.2 R17.1 R22.1 R23.1 R28.1 R29.1 U10.3(GND)
V3.3: C26.1 D5.1(K) D7.1(K) D9.1(K) D10.1(K) D13.1(K) D14.1(K) R13.1 U10.8(VDD)
anAdc0: R26.2 U10.4(AIN0)
anAdc1: R20.2 U10.5(AIN1)
anAdc2: R11.2 U10.6(AIN2)
anAdc3: R16.2 U10.7(AIN3)
EXT_ADC0: R24.1 ; port EXT_ADC0
EXT_ADC1: R18.1 ; port EXT_ADC1
EXT_ADC2: R15.1 ; port EXT_ADC2
EXT_ADC3: R10.1 ; port EXT_ADC3
I2C_SCL: U10.10(SCL) ; port I2C_SCL
I2C_SDA: U10.9(SDA) ; port I2C_SDA
INT_ADC0: R25.1 ; port INT_ADC0
INT_ADC1: R19.1 ; port INT_ADC1
WALT_ADC0: R27.2 ; port WALT_ADC0
WALT_ADC1: R21.2 ; port WALT_ADC1
NetC25_1: C25.1 D5.2(A) D6.1(K) R10.2 R11.1 R12.2
NetC27_1: C27.1 D7.2(A) D8.1(K) R15.2 R16.1 R17.2
NetC28_1: C28.1 D9.2(A) D11.1(K) R18.2 R20.1 R22.2
NetC29_1: C29.1 D10.2(A) D12.1(K) R19.2 R21.1 R23.2
NetC30_1: C30.1 D13.2(A) D15.1(K) R24.2 R26.1 R28.2
NetC31_1: C31.1 D14.2(A) D16.1(K) R25.2 R27.1 R29.2
NetR13_2: R13.2 R14.1 U10.1(ADDR)

Not connected (* = marked no-connect by the designer): U10 2(ALERT/RDY)*

### Notes on the sheet
- Title
- Size:
- Date:
- A4
- Number:
- Time:
- Revision:
- Sheet
- of
- File:

### Library data of the parts
C25-C31 = C: pdf: https://www.lcsc.com/datasheet/lcsc_datasheet_2501031500_HRE-CGA0603X7R104K500JT_C6119867.pdf; LCSC PART: C6119867; lcsc link: https://www.lcsc.com/product-detail/Multilayer-Ceramic-Capacitors-MLCC-SMD-SMT_HRE-CGA0603X7R104K500JT_C6119867.html?s_z=n_100nF; JLCPCB: C6119867; Value: 100nF
D5-D16 = 1N4148_KA: LCSC PART: C84063; JLCPCB: C84063; lcsc link: https://www.lcsc.com/product-detail/Switching-Diodes_Changzhou-Starsea-Elec-1N4148WS_C84063.html?s_z=n_1n4148; pdf: https://www.lcsc.com/datasheet/lcsc_datasheet_1811021610_Changzhou-Starsea-Elec-1N4148WS_C84063.pdf; Value: 1N4148
R10-R29 = R
  R10 R15 R18 R19 R24 R25: JLCPCB: C23186; LCSC PART: C23186; lcsc link: https://www.lcsc.com/product-detail/Chip-Resistor-Surface-Mount_UNI-ROYAL-Uniroyal-Elec-0603WAF5101T5E_C23186.html
  R11 R16 R20 R21 R26 R27: JLCPCB: C2907123; LCSC PART: C2907123; lcsc link: https://www.lcsc.com/product-detail/Chip-Resistor-Surface-Mount_FOJAN-FRC0603J201-TS_C2907123.html
  R12 R17 R22 R23 R28 R29: JLCPCB: C25804; LCSC PART: C25804; lcsc link: https://www.lcsc.com/product-detail/Chip-Resistor-Surface-Mount_UNI-ROYAL-Uniroyal-Elec-0603WAF1002T5E_C25804.html
  R13: Value: DNP
  R14: Value: 0R; JLCPCB: C15402; LCSC PART: C15402; lcsc link: https://www.lcsc.com/product-detail/Chip-Resistor-Surface-Mount_UNI-ROYAL-Uniroyal-Elec-0603WAJ0000T5E_C15402.html
U10 = ADS1015IDGSR: 12-Bit, 3.3kSPS, 4-Ch Delta-Sigma ADC With PGA, Oscillator, VREF, Comparator and I2C Interface 10-VSSOP -40 to 125; Value: ADS1115IDGSR; LCSC PART: C37593; JLCPCB: C37593; lcsc link: https://www.lcsc.com/product-detail/Analog-to-Digital-Converters-ADC_Texas-Instruments-ADS1115IDGSR_C37593.html?s_z=n_ADS1115IDGSR; pdf: https://www.lcsc.com/datasheet/lcsc_datasheet_1809192322_Texas-Instruments-ADS1115IDGSR_C37593.pdf

## Sheet 07 - Leds - OptoCoupler Input.SchDoc
size A4
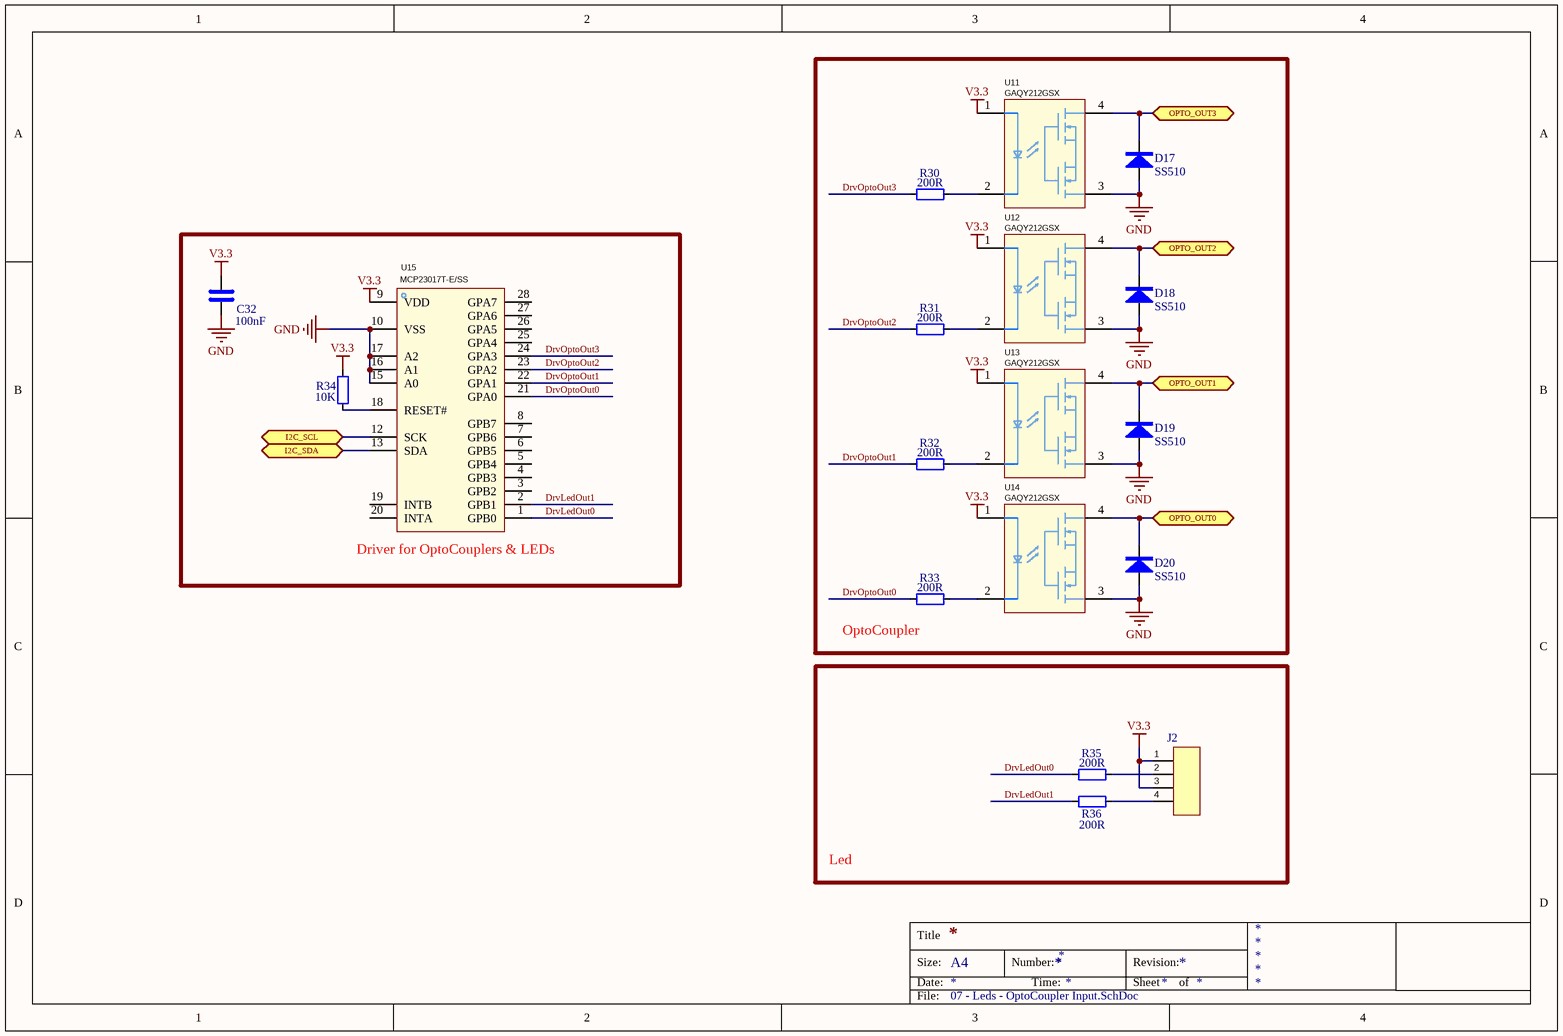
[diagram p6: 07 - Leds - OptoCoupler Input.SchDoc]

### Parts
C32  100nF  [CAP_0603]
D17  value SS510  [S1M-13-F]  (hidden comment: DIODE SCHOTTKY 100V 5A DO214AC)
D18  value SS510  [S1M-13-F]  (hidden comment: DIODE SCHOTTKY 100V 5A DO214AC)
D19  value SS510  [S1M-13-F]  (hidden comment: DIODE SCHOTTKY 100V 5A DO214AC)
D20  value SS510  [S1M-13-F]  (hidden comment: DIODE SCHOTTKY 100V 5A DO214AC)
J2  Conn_01x04_Male  [PinHeader_1x04_P2.54mm_Vertical]  (value not drawn)
R30  value 200R  [RES_0603]  (hidden comment: 200R %5)
R31  value 200R  [RES_0603]  (hidden comment: 200R %5)
R32  value 200R  [RES_0603]  (hidden comment: 200R %5)
R33  value 200R  [RES_0603]  (hidden comment: 200R %5)
R34  value 10K  [RES_0603]  (hidden comment: 10K 1%)
R35  value 200R  [RES_0603]  (hidden comment: 200R %5)
R36  value 200R  [RES_0603]  (hidden comment: 200R %5)
U11  GAQY212GSX  [SOP-4_L4.3-W4.4-P2.54-LS6.8-TR]
U12  GAQY212GSX  [SOP-4_L4.3-W4.4-P2.54-LS6.8-TR]
U13  GAQY212GSX  [SOP-4_L4.3-W4.4-P2.54-LS6.8-TR]
U14  GAQY212GSX  [SOP-4_L4.3-W4.4-P2.54-LS6.8-TR]
U15  MCP23017T-E/SS  [SSOP-28_L10.2-W5.3-P0.65-LS7.8-BL]

### Blocks framed on the sheet
OptoCoupler: D17-D20 R30-R33 U11-U14
Driver for OptoCouplers & LEDs: C32 R34 U15
Led: J2 R35 R36

### Ports
I2C_SCL (bidir), I2C_SDA (bidir), OPTO_OUT0 (bidir), OPTO_OUT1 (bidir), OPTO_OUT2 (bidir), OPTO_OUT3 (bidir)

### Nets
GND: C32.2 D17.2(A) D18.2(A) D19.2(A) D20.2(A) U11.3 U12.3 U13.3 U14.3 U15.10(VSS) U15.15(A0) U15.16(A1) U15.17(A2)
V3.3: C32.1 J2.1(Pin_1) J2.3(Pin_3) R34.2 U11.1 U12.1 U13.1 U14.1 U15.9(VDD)
DrvLedOut0: R35.1 U15.1(GPB0)
DrvLedOut1: R36.1 U15.2(GPB1)
DrvOptoOut0: R33.1 U15.21(GPA0)
DrvOptoOut1: R32.1 U15.22(GPA1)
DrvOptoOut2: R31.1 U15.23(GPA2)
DrvOptoOut3: R30.1 U15.24(GPA3)
I2C_SCL: U15.12(SCK) ; port I2C_SCL
I2C_SDA: U15.13(SDA) ; port I2C_SDA
OPTO_OUT0: D20.1(K) U14.4 ; port OPTO_OUT0
OPTO_OUT1: D19.1(K) U13.4 ; port OPTO_OUT1
OPTO_OUT2: D18.1(K) U12.4 ; port OPTO_OUT2
OPTO_OUT3: D17.1(K) U11.4 ; port OPTO_OUT3
NetJ2_2: J2.2(Pin_2) R35.2
NetJ2_4: J2.4(Pin_4) R36.2
NetR30_2: R30.2 U11.2
NetR31_2: R31.2 U12.2
NetR32_2: R32.2 U13.2
NetR33_2: R33.2 U14.2
NetR34_1: R34.1 U15.18(RESET#)

Not connected (* = marked no-connect by the designer): U15 3(GPB2) 4(GPB3) 5(GPB4) 6(GPB5) 7(GPB6) 8(GPB7) 11(NC) 14(NC) 19(INTB) 20(INTA) 25(GPA4) 26(GPA5) 27(GPA6) 28(GPA7)

### Notes on the sheet
- Title
- Size:
- Date:
- A4
- Number:
- Time:
- Revision:
- Sheet
- of
- File:

### Library data of the parts
C32 = C: pdf: https://www.lcsc.com/datasheet/lcsc_datasheet_2501031500_HRE-CGA0603X7R104K500JT_C6119867.pdf; LCSC PART: C6119867; lcsc link: https://www.lcsc.com/product-detail/Multilayer-Ceramic-Capacitors-MLCC-SMD-SMT_HRE-CGA0603X7R104K500JT_C6119867.html?s_z=n_100nF; JLCPCB: C6119867; Value: 100nF
D17-D20 = DIODE SCHOTTKY 100V 5A DO214AC: as D1 on sheet 02 - Power; NAME: DIODE SCHOTTKY 100V 5A DO214AC; Datasheet: https://www.smc-diodes.com/propdf/SK510%20N1113%20REV.A.pdf; lcsc link: https://www.lcsc.com/product-detail/Schottky-Diodes_MDD-Microdiode-Semiconductor-SS510_C65010.html; JLCPCB: C65010; LCSC PART: C65010; pdf: https://www.lcsc.com/datasheet/lcsc_datasheet_2411211954_MDD-Microdiode-Semiconductor-SS510_C65010.pdf
J2 = Conn_01x04_Male: 4P 2.54mm Single Row 1x4P Plugin,P=2.54mm Pin Headers ROHS; JLCPCB: C5116483; Value: Conn_01x04_Male; LCSC PART: C5116483; pdf: https://www.lcsc.com/product-detail/Pin-Headers_ZHOURI-2-54-1-4_C5116483.html?s_z=n_C5116483; lcsc link: https://www.lcsc.com/product-detail/Pin-Headers_ZHOURI-2-54-1-4_C5116483.html?s_z=n_C5116483
R30-R36 = R
  R30-R33 R35 R36: JLCPCB: C2907123; LCSC PART: C2907123; lcsc link: https://www.lcsc.com/product-detail/Chip-Resistor-Surface-Mount_FOJAN-FRC0603J201-TS_C2907123.html
  R34: JLCPCB: C25804; LCSC PART: C25804; lcsc link: https://www.lcsc.com/product-detail/Chip-Resistor-Surface-Mount_UNI-ROYAL-Uniroyal-Elec-0603WAF1002T5E_C25804.html
U11-U14 = GAQY212GSX: 1.32V 60V 180mΩ 1A SOP-4 Solid State Relays (MOS Output) ROHS; Manufacturer: SUPSiC(国晶微半导体); Add into BOM: yes; Isolation Voltage(rms): 2.5kV; Turn-on time: 350us; Turn-off time: 100us; Symbol: GAQY212GSX; Device: GAQY212GSX; LCSC Part Name: 固态继电器; Supplier Part: C19271988; Manufacturer Part: GAQY212GSX; Supplier Footprint: SOP-4; JLCPCB Part Class: Extended Part; Datasheet: https://atta.szlcsc.com/upload/public/pdf/source/20241011/A89ED24ACAE58F7B7A4718E65AC52A14.pdf; Supplier: LCSC; Convert to PCB: yes; Relay Contact Form: -; Load Type: -; Input Forward Voltage: 1.32V; Voltage - Load: 60V; Continuous Load Current: 1A; On Resistance: 180mΩ; LCSC PART: C19271988; lcsc link: https://www.lcsc.com/product-detail/Solid-State-Relays-MOS-Output_SUPSiC-GAQY212GSX_C19271988.html; pdf: https://www.lcsc.com/datasheet/lcsc_datasheet_2411220035_SUPSiC-GAQY212GSX_C19271988.pdf; Value: GAQY212GSX; JLCPCB: C19271988
U15 = MCP23017T-E/SS: 16-Bit I/O Expander with Serial Interface; Manufacturer: MICROCHIP(美国微芯); Add into BOM: yes; Number of I/O: 16; Interrupt Output: With Interrupt Output; Supply Voltage: 1.8V~5.5V; Symbol: MCP23017T-E/SS; Device: MCP23017T-E/SS; LCSC Part Name: 16位带串行接口的I/O扩展器; Supplier Part: C558584; Manufacturer Part: MCP23017T-E/SS; Supplier Footprint: SSOP-28; JLCPCB Part Class: Extended Part; Datasheet: https://atta.szlcsc.com/upload/public/pdf/source/20221209/1BF939F88C2D907BC056D7BF485E3103.pdf; Supplier: LCSC; Convert to PCB: yes; Output Source current: -; Output Sink Current: -; Clock Frequency: -; Operating Temperature: -40℃~+125℃; LCSC PART: C558584; JLCPCB: C558584; lcsc link: https://www.lcsc.com/product-detail/I-O-Expanders_Microchip-Tech-MCP23017T-E-SS_C558584.html?s_z=n_MCP23017; pdf: https://www.lcsc.com/datasheet/lcsc_datasheet_2410122007_Microchip-Tech-MCP23017T-E-SS_C558584.pdf; Value: MCP23017T-E/SS

## Sheet 08 - RTD.SchDoc
size A4
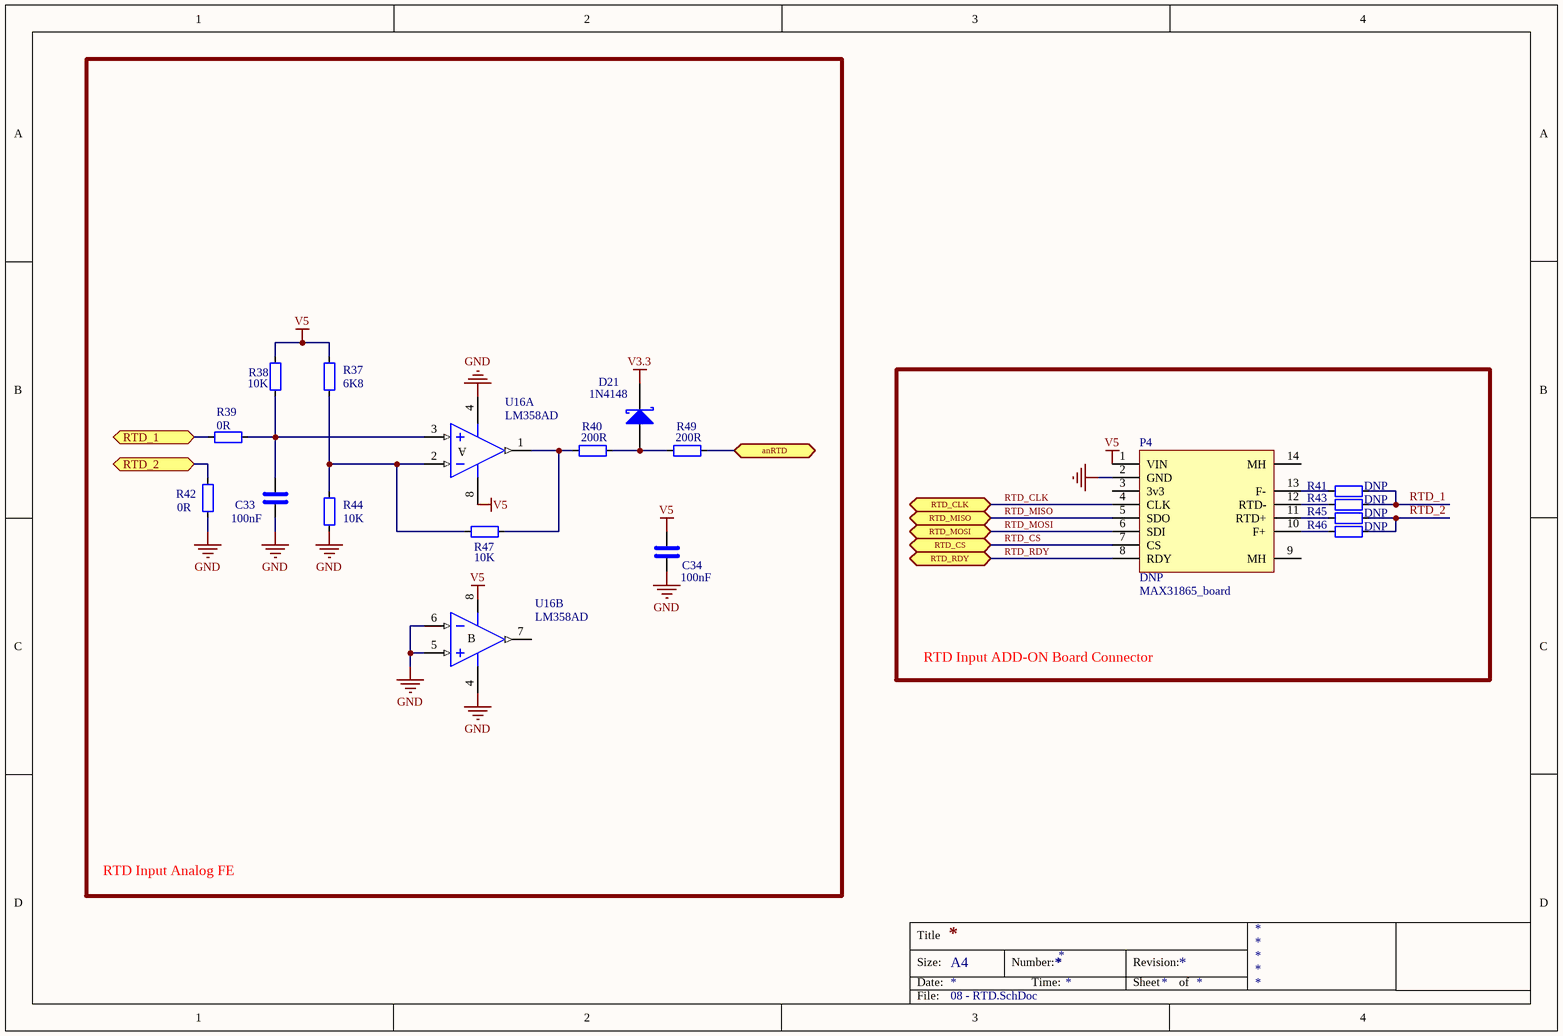
[diagram p7: 08 - RTD.SchDoc]

### Parts
C33  100nF  [CAP_0603]
C34  100nF  [CAP_0603]
D21  1N4148  [SOD323_STM_NW]
P4  DNP  value MAX31865_board  [MAX31865_board]
R37  value 6K8  [RES_0603]  (hidden comment: 60.4Ω)
R38  value 10K  [RES_0603]  (hidden comment: 10K 1%)
R39  0R  [RES_0603]
R40  value 200R  [RES_0603]  (hidden comment: 200R %5)
R41  DNP  [RES_0603]
R42  0R  [RES_0603]
R43  DNP  [RES_0603]
R44  value 10K  [RES_0603]  (hidden comment: 10K 1%)
R45  DNP  [RES_0603]
R46  DNP  [RES_0603]
R47  value 10K  [RES_0603]  (hidden comment: 10K 1%)
R49  value 200R  [RES_0603]  (hidden comment: 200R %5)
U16  LM358AD  [SO8_M]  (parts A,B of 2)

### Blocks framed on the sheet
RTD Input Analog FE: C33 C34 D21 R37-R40 R42 R44 R47 R49 U16
RTD Input ADD-ON Board Connector: P4 R41 R43 R45 R46

### Ports
anRTD (bidir), RTD_1 (bidir), RTD_2 (bidir), RTD_CLK (bidir), RTD_CS (bidir), RTD_MISO (bidir), RTD_MOSI (bidir), RTD_RDY (bidir)

### Nets
GND: C33.2 C34.2 P4.2(GND) R42.2 R44.1 U16.4(V-) U16.5(IN+) U16.6(IN-)
V3.3: D21.1(K)
V5: C34.1 P4.1(VIN) R37.1 R38.2 U16.8(V+)
RTD_1: R39.1 R41.1 R43.1 ; port RTD_1
RTD_2: R42.1 R45.1 R46.1 ; port RTD_2
RTD_CLK: P4.4(CLK) ; port RTD_CLK
RTD_CS: P4.7(CS) ; port RTD_CS
RTD_MISO: P4.5(SDO) ; port RTD_MISO
RTD_MOSI: P4.6(SDI) ; port RTD_MOSI
RTD_RDY: P4.8(RDY) ; port RTD_RDY
WALT_ADC2: R49.2 ; port anRTD
NetC33_1: C33.1 R38.1 R39.2 U16.3(IN+)
NetD21_2: D21.2(A) R40.2 R49.1
NetP4_10: P4.10(F+) R46.2
NetP4_11: P4.11(RTD+) R45.2
NetP4_12: P4.12(RTD-) R43.2
NetP4_13: P4.13(F-) R41.2
NetR37_2: R37.2 R44.2 R47.2 U16.2(IN-)
NetR40_1: R40.1 R47.1 U16.1(OUT)

Not connected (* = marked no-connect by the designer): P4 3(3v3) 9(MH) 14(MH); U16 7(OUT)

### Notes on the sheet
- Labels drawn without touching a wire or pin: V5
- Title
- Size:
- Date:
- A4
- Number:
- Time:
- Revision:
- Sheet
- of
- File:
- (in symbol LM358AD, part A) A
- (in symbol LM358AD, part B) B

### Library data of the parts
C33 C34 = C: pdf: https://www.lcsc.com/datasheet/lcsc_datasheet_2501031500_HRE-CGA0603X7R104K500JT_C6119867.pdf; LCSC PART: C6119867; lcsc link: https://www.lcsc.com/product-detail/Multilayer-Ceramic-Capacitors-MLCC-SMD-SMT_HRE-CGA0603X7R104K500JT_C6119867.html?s_z=n_100nF; JLCPCB: C6119867; Value: 100nF
D21 = 1N4148_KA: LCSC PART: C84063; JLCPCB: C84063; lcsc link: https://www.lcsc.com/product-detail/Switching-Diodes_Changzhou-Starsea-Elec-1N4148WS_C84063.html?s_z=n_1n4148; pdf: https://www.lcsc.com/datasheet/lcsc_datasheet_1811021610_Changzhou-Starsea-Elec-1N4148WS_C84063.pdf; Value: 1N4148
P4 = MAX31865_board: LatestRevisionDate: 17-Jul-2002; LatestRevisionNote: Re-released for DXP Platform.; Publisher: Altium Limited
R37-R47 R49 = R
  R38 R44 R47: JLCPCB: C25804; LCSC PART: C25804; lcsc link: https://www.lcsc.com/product-detail/Chip-Resistor-Surface-Mount_UNI-ROYAL-Uniroyal-Elec-0603WAF1002T5E_C25804.html
  R39 R42: Value: 0R; JLCPCB: C15402; LCSC PART: C15402; lcsc link: https://www.lcsc.com/product-detail/Chip-Resistor-Surface-Mount_UNI-ROYAL-Uniroyal-Elec-0603WAJ0000T5E_C15402.html
  R40 R49: JLCPCB: C2907123; LCSC PART: C2907123; lcsc link: https://www.lcsc.com/product-detail/Chip-Resistor-Surface-Mount_FOJAN-FRC0603J201-TS_C2907123.html
  R41 R43 R45 R46: Value: DNP
U16 = LM358AD: Low-Power Dual Operational Amplifier; Published: 24-Aug-2001; LatestRevisionDate: 13-Apr-2006; LatestRevisionNote: IPC-7351 Footprint Added.; DatasheetVersion: Jun-1998; PackageVersion: Dec-2002; PackageReference: SO8; Publisher: Altium Limited; PackageDescription: 8-Pin Small Outline Integrated Circuit 1.27 mm Pitch; Code_JEDEC: MS-012-AA; Code_IPC: SOIC127P600-8; ComponentLink1Description: Manufacturer Link; ComponentLink1URL: http://www.st.com/; ComponentLink2Description: Datasheet; ComponentLink2URL: http://www.st.com/stonline/products/literature/ds/2163/lm358.pdf; LCSC PART: C5423; lcsc link: https://www.lcsc.com/product-detail/Operational-Amplifier_Texas-Instruments-LM358DR_C5423.html?s_z=n_lm358; JLCPCB: C5423; pdf: https://www.lcsc.com/datasheet/lcsc_datasheet_1810181640_Texas-Instruments-LM358DR_C5423.pdf; Value: LM358AD

## Sheet 01 - Walter_IO.SchDoc
size A4
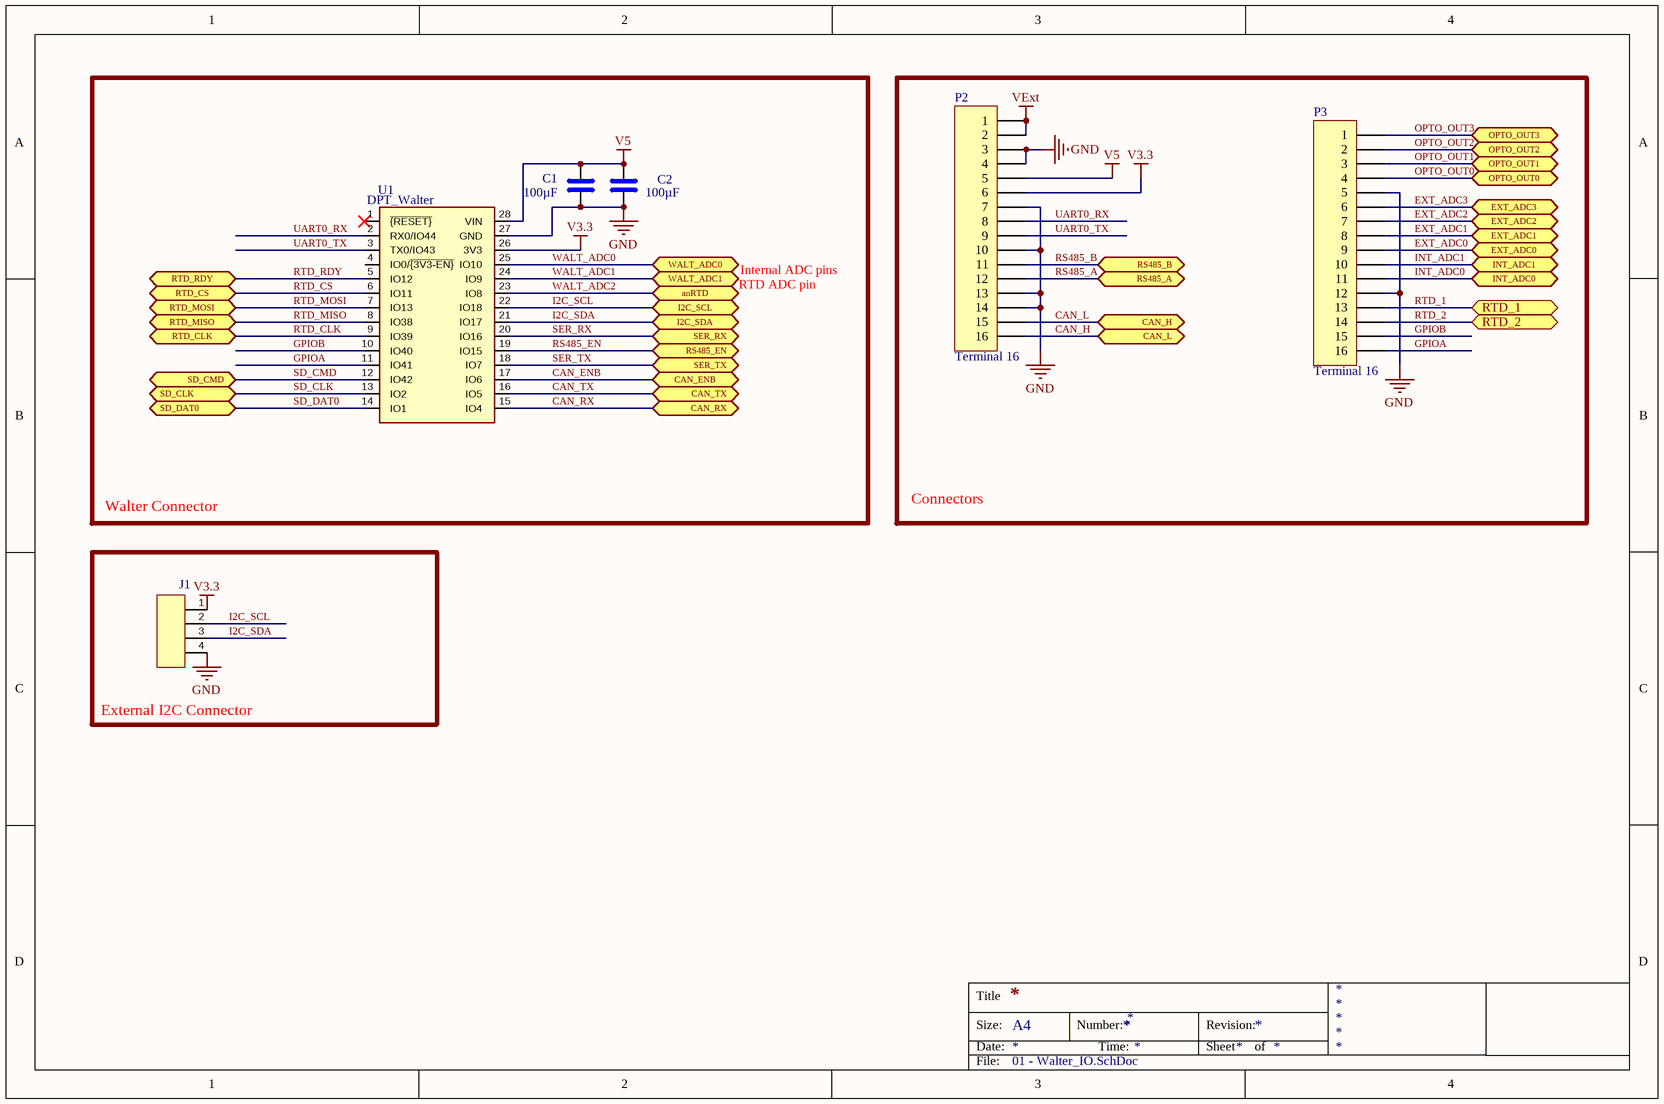
[diagram p8: 01 - Walter_IO.SchDoc]

### Parts
C1  100µF  [C_1210_3225Metric]
C2  100µF  [C_1210_3225Metric]
J1  Conn_01x04_Male  [PinHeader_1x04_P2.54mm_Vertical]  (value not drawn)
P2  Terminal 16  [CONN-TH_250-216]
P3  Terminal 16  [CONN-TH_250-216]
U1  value DPT_Walter  [walter-socket]  (hidden comment: DNP)

### Blocks framed on the sheet
Walter Connector: C1 C2 U1
Connectors: P2 P3
External I2C Connector: J1

### Ports
anRTD (bidir), CAN_ENB (bidir), CAN_H (bidir), CAN_L (bidir), CAN_RX (bidir), CAN_TX (bidir), EXT_ADC0 (bidir), EXT_ADC1 (bidir), EXT_ADC2 (bidir), EXT_ADC3 (bidir), I2C_SCL (bidir), I2C_SDA (bidir), INT_ADC0 (bidir), INT_ADC1 (bidir), OPTO_OUT0 (bidir), OPTO_OUT1 (bidir), OPTO_OUT2 (bidir), OPTO_OUT3 (bidir), RS485_A (bidir), RS485_B (bidir), RS485_EN (bidir), RTD_1 (bidir), RTD_2 (bidir), RTD_CLK (bidir), RTD_CS (bidir), RTD_MISO (bidir), RTD_MOSI (bidir), RTD_RDY (bidir), SD_CLK (bidir), SD_CMD (bidir), SD_DAT0 (bidir), SER_RX (bidir), SER_TX (bidir), WALT_ADC0 (bidir), WALT_ADC1 (bidir)

### Nets
GND: C1.2 C2.2 J1.4(Pin_4) P2.3 P2.4 P2.7 P2.10 P2.13 P2.14 P3.5 P3.12 U1.27(GND)
V3.3: J1.1(Pin_1) P2.6 U1.26(3V3)
V5: C1.1 C2.1 P2.5 U1.28(VIN)
VExt: P2.1 P2.2
CAN_ENB: U1.17(IO6) ; port CAN_ENB
CAN_H: P2.16 ; port CAN_L
CAN_L: P2.15 ; port CAN_H
CAN_RX: U1.15(IO4) ; port CAN_RX
CAN_TX: U1.16(IO5) ; port CAN_TX
EXT_ADC0: P3.9 ; port EXT_ADC0
EXT_ADC1: P3.8 ; port EXT_ADC1
EXT_ADC2: P3.7 ; port EXT_ADC2
EXT_ADC3: P3.6 ; port EXT_ADC3
GPIOA: P3.16 U1.11(IO41)
GPIOB: P3.15 U1.10(IO40)
I2C_SCL: J1.2(Pin_2) U1.22(IO18) ; port I2C_SCL
I2C_SDA: J1.3(Pin_3) U1.21(IO17) ; port I2C_SDA
INT_ADC0: P3.11 ; port INT_ADC0
INT_ADC1: P3.10 ; port INT_ADC1
OPTO_OUT0: P3.4 ; port OPTO_OUT0
OPTO_OUT1: P3.3 ; port OPTO_OUT1
OPTO_OUT2: P3.2 ; port OPTO_OUT2
OPTO_OUT3: P3.1 ; port OPTO_OUT3
RS485_A: P2.12 ; port RS485_A
RS485_B: P2.11 ; port RS485_B
RS485_EN: U1.19(IO15) ; port RS485_EN
RTD_1: P3.13 ; port RTD_1
RTD_2: P3.14 ; port RTD_2
RTD_CLK: U1.9(IO39) ; port RTD_CLK
RTD_CS: U1.6(IO11) ; port RTD_CS
RTD_MISO: U1.8(IO38) ; port RTD_MISO
RTD_MOSI: U1.7(IO13) ; port RTD_MOSI
RTD_RDY: U1.5(IO12) ; port RTD_RDY
SD_CLK: U1.13(IO2) ; port SD_CLK
SD_CMD: U1.12(IO42) ; port SD_CMD
SD_DAT0: U1.14(IO1) ; port SD_DAT0
SER_RX: U1.20(IO16) ; port SER_RX
SER_TX: U1.18(IO7) ; port SER_TX
UART0_RX: P2.8 U1.2(RX0/IO44)
UART0_TX: P2.9 U1.3(TX0/IO43)
WALT_ADC0: U1.25(IO10) ; port WALT_ADC0
WALT_ADC1: U1.24(IO9) ; port WALT_ADC1
WALT_ADC2: U1.23(IO8) ; port anRTD

Not connected (* = marked no-connect by the designer): U1 1(~{{RESET}}) 4(IO0/~{{3V3-EN}})

### Notes on the sheet
- RTD ADC pin
- Internal ADC pins
- Title
- Size:
- Date:
- A4
- Number:
- Time:
- Revision:
- Sheet
- of
- File:

### Library data of the parts
C1 C2 = C: as C7 on sheet 02 - Power; JLCPCB: C49066; Value: 100µF; LCSC PART: C49066; lcsc link: https://www.lcsc.com/product-detail/Multilayer-Ceramic-Capacitors-MLCC-SMD-SMT_Samsung-Electro-Mechanics-CL32A107MQVNNNE_C49066.html?s_z=n_C49066
J1 = Conn_01x04_Male: as J2 on sheet 07 - Leds - OptoCoupler Input; JLCPCB: C5116483; Value: Conn_01x04_Male; LCSC PART: C5116483; pdf: https://www.lcsc.com/product-detail/Pin-Headers_ZHOURI-2-54-1-4_C5116483.html?s_z=n_C5116483; lcsc link: https://www.lcsc.com/product-detail/Pin-Headers_ZHOURI-2-54-1-4_C5116483.html?s_z=n_C5116483
P2 P3 = Header 16: 3.5mm 1x16P -60℃~+105℃ 16P Gray 16 1 Plugin,P=3.5mm Spring Clamp System Terminal Block; LatestRevisionDate: 17-Jul-2002; LatestRevisionNote: Re-released for DXP Platform.; Publisher: Altium Limited; lcsc link: https://www.lcsc.com/product-detail/Spring-Clamp-System-Terminal-Block_WAGO-250-216_C2833595.html; LCSC PART: C2833595; JLCPCB: C2833595; pdf: https://www.lcsc.com/datasheet/lcsc_datasheet_2410121253_WAGO-250-216_C2833595.pdf; Value: Terminal 16
U1 = DPT_Walter

## Nets that join several sheets
GND: 02 - Power (13 pins), 03 - Sensors (14 pins), 04 - Storage (9 pins), 05 - CAN_RS485 (12 pins), 06 - External ADC (21 pins), 07 - Leds - OptoCoupler Input (13 pins), 08 - RTD (8 pins), 01 - Walter_IO (12 pins)
V3.3: 03 - Sensors (14 pins), 04 - Storage (6 pins), 05 - CAN_RS485 (C21.1 U8.8), 06 - External ADC (9 pins), 07 - Leds - OptoCoupler Input (9 pins), 08 - RTD (D21.1), 01 - Walter_IO (J1.1 P2.6 U1.26)
V5: 02 - Power (5 pins), 05 - CAN_RS485 (U7.5), 08 - RTD (5 pins), 01 - Walter_IO (C1.1 C2.1 P2.5 U1.28)
VExt: 02 - Power (D1.2), 01 - Walter_IO (P2.1 P2.2)
CAN_ENB: 05 - CAN_RS485 (R55.1 U7.4), 01 - Walter_IO (U1.17)
CAN_H: 05 - CAN_RS485 (C23.1 D4.2 L2.1 R8.1), 01 - Walter_IO (P2.16)
CAN_L: 05 - CAN_RS485 (C24.1 D4.1 L2.2 R9.1), 01 - Walter_IO (P2.15)
CAN_RX: 05 - CAN_RS485 (U9.4), 01 - Walter_IO (U1.15)
CAN_TX: 05 - CAN_RS485 (U9.1), 01 - Walter_IO (U1.16)
EXT_ADC0: 06 - External ADC (R24.1), 01 - Walter_IO (P3.9)
EXT_ADC1: 06 - External ADC (R18.1), 01 - Walter_IO (P3.8)
EXT_ADC2: 06 - External ADC (R15.1), 01 - Walter_IO (P3.7)
EXT_ADC3: 06 - External ADC (R10.1), 01 - Walter_IO (P3.6)
I2C_SCL: 03 - Sensors (R6.1 U3.2 U4.13 U5.6), 06 - External ADC (U10.10), 07 - Leds - OptoCoupler Input (U15.12), 01 - Walter_IO (J1.2 U1.22)
I2C_SDA: 03 - Sensors (R7.1 U3.4 U4.14 U5.1), 06 - External ADC (U10.9), 07 - Leds - OptoCoupler Input (U15.13), 01 - Walter_IO (J1.3 U1.21)
INT_ADC0: 06 - External ADC (R25.1), 01 - Walter_IO (P3.11)
INT_ADC1: 06 - External ADC (R19.1), 01 - Walter_IO (P3.10)
OPTO_OUT0: 07 - Leds - OptoCoupler Input (D20.1 U14.4), 01 - Walter_IO (P3.4)
OPTO_OUT1: 07 - Leds - OptoCoupler Input (D19.1 U13.4), 01 - Walter_IO (P3.3)
OPTO_OUT2: 07 - Leds - OptoCoupler Input (D18.1 U12.4), 01 - Walter_IO (P3.2)
OPTO_OUT3: 07 - Leds - OptoCoupler Input (D17.1 U11.4), 01 - Walter_IO (P3.1)
RS485_A: 05 - CAN_RS485 (U8.6), 01 - Walter_IO (P2.12)
RS485_B: 05 - CAN_RS485 (U8.7), 01 - Walter_IO (P2.11)
RS485_EN: 05 - CAN_RS485 (U8.2 U8.3), 01 - Walter_IO (U1.19)
RTD_1: 08 - RTD (R39.1 R41.1 R43.1), 01 - Walter_IO (P3.13)
RTD_2: 08 - RTD (R42.1 R45.1 R46.1), 01 - Walter_IO (P3.14)
RTD_CLK: 08 - RTD (P4.4), 01 - Walter_IO (U1.9)
RTD_CS: 08 - RTD (P4.7), 01 - Walter_IO (U1.6)
RTD_MISO: 08 - RTD (P4.5), 01 - Walter_IO (U1.8)
RTD_MOSI: 08 - RTD (P4.6), 01 - Walter_IO (U1.7)
RTD_RDY: 08 - RTD (P4.8), 01 - Walter_IO (U1.5)
SD_CLK: 04 - Storage (R53.1), 01 - Walter_IO (U1.13)
SD_CMD: 04 - Storage (R54.1), 01 - Walter_IO (U1.12)
SD_DAT0: 04 - Storage (R52.1), 01 - Walter_IO (U1.14)
SER_RX: 05 - CAN_RS485 (U8.1), 01 - Walter_IO (U1.20)
SER_TX: 05 - CAN_RS485 (U8.4), 01 - Walter_IO (U1.18)
WALT_ADC0: 06 - External ADC (R27.2), 01 - Walter_IO (U1.25)
WALT_ADC1: 06 - External ADC (R21.2), 01 - Walter_IO (U1.24)
WALT_ADC2: 08 - RTD (R49.2), 01 - Walter_IO (U1.23)

## Assembly variants
DV1: not fitted P4 R5 R13 R41 R43 R45 R46 U1